# EAGLE design YAPHITS (EAGLE 9.6.2)
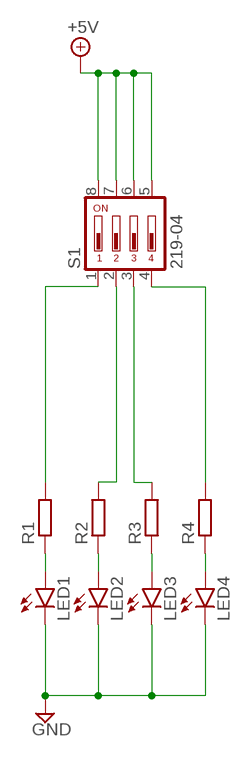
[diagram p0: schematic, sheet 1]

## Parts
LED1  LAP4-BOTTOM  [P47F-BOTTOM]
LED2  LAP4-BOTTOM  [P47F-BOTTOM]
LED3  LAP4-BOTTOM  [P47F-BOTTOM]
LED4  LAP4-BOTTOM  [P47F-BOTTOM]
R1  R-EU_0204/7  [0204/7]
R2  R-EU_0204/7  [0204/7]
R3  R-EU_0204/7  [0204/7]
R4  R-EU_0204/7  [0204/7]
S1  219-04  [CTS-219-04]

## Nets
+5V: S1.5 S1.6 S1.7 S1.8
GND: LED1.C LED2.C LED3.C LED4.C
N$1: R1.2 S1.1
N$2: R2.2 S1.2
N$3: R3.2 S1.3
N$4: R4.2 S1.4
N$5: LED1.A R1.1
N$6: LED2.A R2.1
N$7: LED3.A R3.1
N$8: LED4.A R4.1

## Library data of the parts
LED1-LED4 = led:*P4: PointLED® Enhanced Thinfilm LED TOP & BOTTOM mount LS P47F, LR P47F, LA P47F, LY P47F, LT P4SG, LB P4SG, LW P4SG Source: http://catalog.osram-os.com .. LA_LR_LS_LY_P47F_Pb_free.pdf
R1-R4 = rcl:R-EU_: RESISTOR, European symbol; SPICEPREFIX: R
S1 = switch-dil:219-04*: Surface Mount DIP Switch Series 219 SMT CTS Electronic Components Sourc: www.ctscorp.com; OC_FARNELL: unknown; OC_NEWARK: unknown

## Board
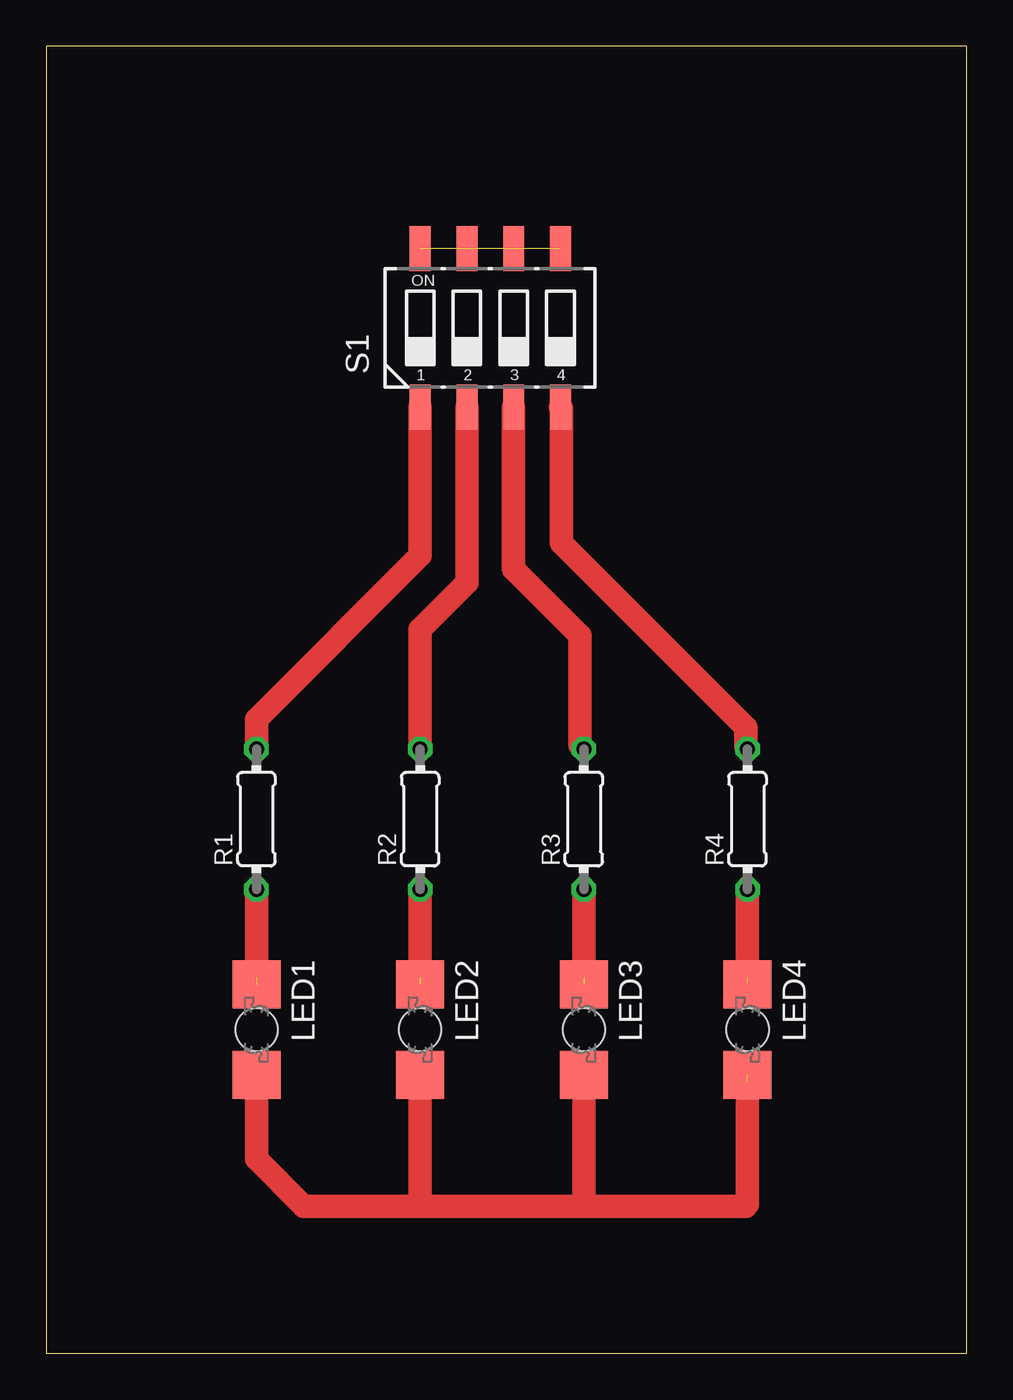
[diagram p1: board, top side]
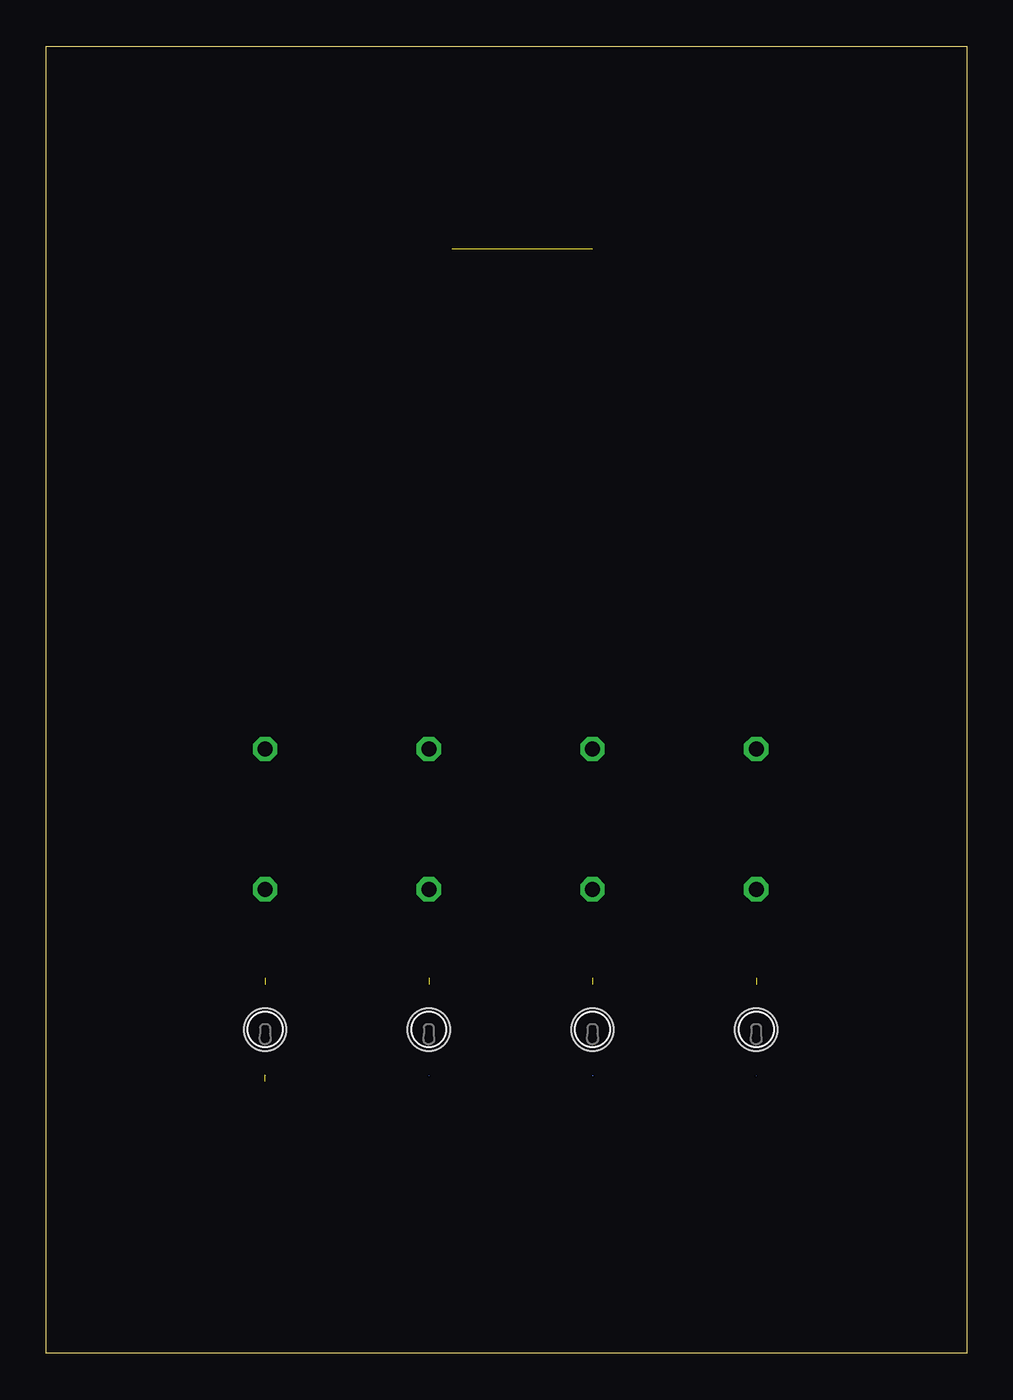
[diagram p2: board, bottom side, seen from below]

Size 50 x 71 mm. Coordinates in mm from the lower left corner, seen from the top.
Outline: 0,0 50,0 50,71 0,71 0,0
Copper layers (1*16): Top 0.035mm / dielectric 1.5mm / Bottom 0.035mm
Design rules "default": minimum track width 6mil, minimum drill 0.35mm, track to track 6mil, track to pad 6mil, pad to pad 6mil, via to via 6mil, smd to smd 6mil, copper to edge 40mil, drill to drill 6mil, minimum pad ring 10mil, minimum via ring 8mil, stop-mask expansion 4mil, vias tented up to drill 0mil, thermal gap 10mil

### Footprints (pad centres in the part's own frame; a part is rotated, then mirrored left to right if it is on the bottom)
P47F-BOTTOM = smd 2.6 x 2.6: A -2.45,0; C 2.45,0 | hole 2.3: 0,0
0204/7 = drill 0.813 octagon: 1 -3.81,0; 2 3.81,0
CTS-219-04 = smd 1.13 x 2.44: 1 -3.81,-4.3; 2 -1.27,-4.3; 3 1.27,-4.3; 4 3.81,-4.3; 5 3.81,4.3; 6 1.27,4.3; 7 -1.27,4.3; 8 -3.81,4.3

### Placement (x,y rotation side)
LED1  11.43,17.59 270 top
LED2  20.32,17.59 270 top
LED3  29.21,17.59 270 top
LED4  38.1,17.59 270 top
R1  11.43,29.02 90 top
R2  20.32,29.02 90 top
R3  29.21,29.02 90 top
R4  38.1,29.02 90 top
S1  24.13,55.69 0 top

### Tracks (layer width: path | path; a pad name or v marks a point on that pad's centre or on a via)
+5V  (3 unrouted)
GND  (1 unrouted)
  Top 1.27: LED1.C 11.43,10.57 14,8 20,8 | 20,8 29,8 | 29,8 38,8 38.1,8.1 38.1,14.79 | LED2.C 20.32,8.32 20,8 | LED3.C 29.21,8.21 29,8
N$1
  Top 1.27: S1.1 20.32,43.32 11.43,34.43 R1.2
N$2
  Top 1.27: S1.2 22.86,41.86 20.32,39.32 R2.2
N$3
  Top 1.27: R3.2 29,33.04 29,39 25.4,42.6 S1.3
N$4
  Top 1.27: S1.4 28,51.33 28,44 38,34 38,32.93 R4.2
N$5  (1 unrouted)
  Top 1.27: R1.1 11.43,20.39
N$6  (1 unrouted)
  Top 1.27: R2.1 20.32,20.39
N$7  (1 unrouted)
  Top 1.27: R3.1 29.21,20.39
N$8  (1 unrouted)
  Top 1.27: R4.1 38.1,20.39